# Altium schematic sheet External_connectors.SchDoc: External connectors.
size 297 x 209 mm; Author: Dmitry Shpakov; Organization: NoName; Revision: Revision; SheetNumber: 8; SheetTotal: 10; PageSize: A4; ProjectName: Project Name
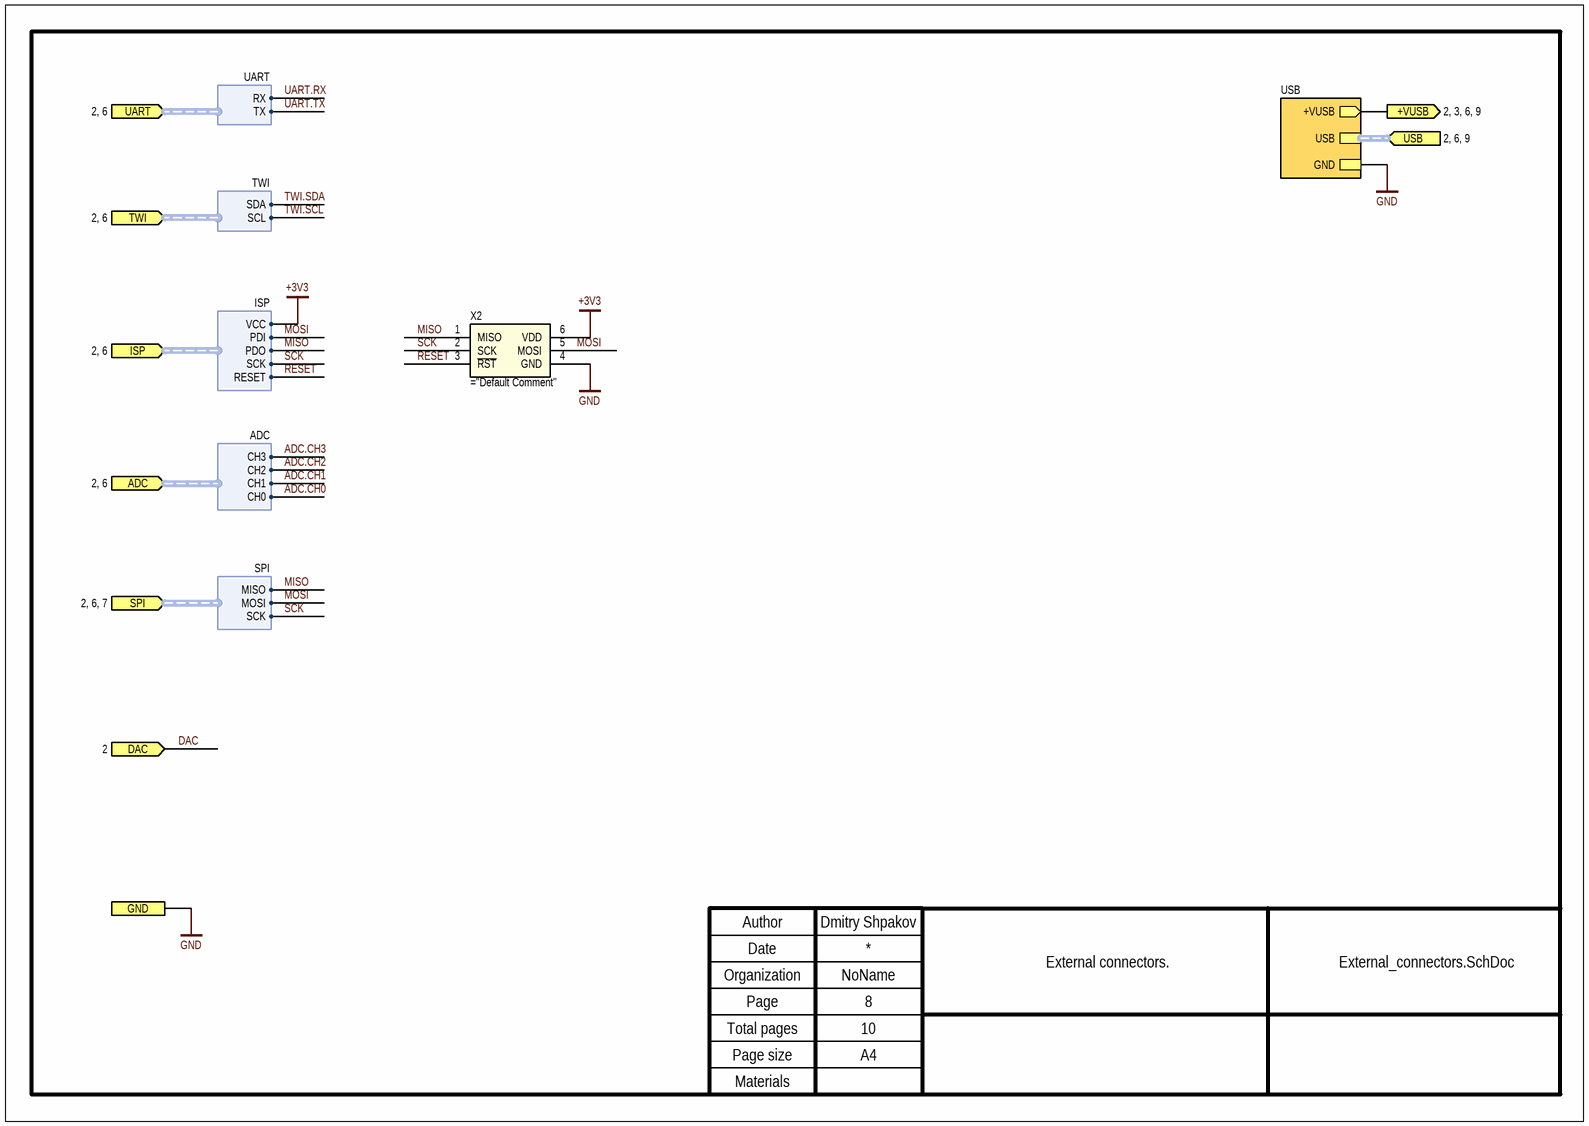
[diagram p0: External_connectors.SchDoc]

## Parts
X2  (no value)  (no BOM)

## Sub-sheets
USB = USB.SchDoc: USB (harness USB), +VUSB (out), GND

## Ports
+VUSB (out, see 2, 3, 6, 9), ADC (in, harness ADC, see 2, 6), DAC (in, see 2), GND (see 2, 3, 4, 5, 6, 7, 9, 10), ISP (in, harness ISP, see 2, 6), SPI (in, harness SPI, see 2, 6, 7), TWI (in, harness TWI, see 2, 6), UART (in, harness UART, see 2, 6), USB (in, see 2, 6, 9)

## Harnesses
UART: RX, TX
TWI: SDA, SCL
ISP: VCC, PDI, PDO, SCK, RESET
ADC: CH3, CH2, CH1, CH0
SPI: MISO, MOSI, SCK

## Nets
+3V3: X2.6(VDD) ; port ISP.VCC
GND: X2.4(GND) ; port GND, sheet USB/GND
+VUSB: port +VUSB, sheet USB/+VUSB
ADC.CH0: port ADC.CH0
ADC.CH1: port ADC.CH1
ADC.CH2: port ADC.CH2
ADC.CH3: port ADC.CH3
DAC: port DAC
MISO: X2.1(MISO) ; port ISP.PDO, port SPI.MISO
MOSI: X2.5(MOSI) ; port ISP.PDI, port SPI.MOSI
~{RESET}: X2.3(~{RST}) ; port ISP.RESET
SCK: X2.2(SCK) ; port ISP.SCK, port SPI.SCK
TWI.SCL: port TWI.SCL
TWI.SDA: port TWI.SDA
UART.RX: port UART.RX
UART.TX: port UART.TX

## Buses and harness runs
harness port USB = sheet USB/USB

## Notes on the sheet
- Author
- Date
- Organization
- Page
- Total pages
- Materials
- Page size

## Library data of the parts
X2 = ISP: In system programming interface.; Power Dissipation: * W; Rated Voltage: * V; Rated Current: * A; Tolerance: * %; Value: ISP; Operating Temperature: *; Type: connector; HelpURL: *; Default Comment: ISP; Rated Power: * W; Other: *; Summary: ="Type"+" "+"Part Number"+" "+"Manufacturer"+" "+"Value"+" "+"Tolerance"+" "+"Operating Temperature"+" "+"Case"+" "+"Power Dissipation"+" "+"Rated Current"+" "+"Rated Power"+" "+"Rated Voltage"+" "+"Other"; Assembly: *; Case: *; Manufacturer: *; Part Number: *